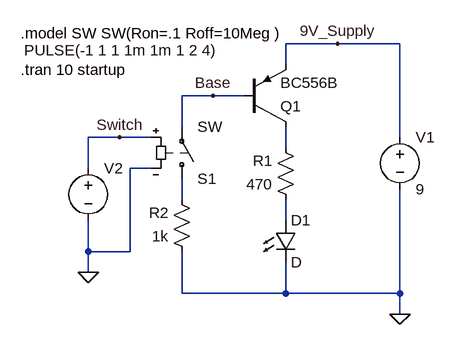
[diagram p0: schematic LTSpice_Example_001.asc]
LTSpice_Example_001.asc, the LTspice schematic file:
Version 4
SHEET 1 880 680
WIRE 208 0 128 0
WIRE 304 0 208 0
WIRE 128 32 128 0
WIRE 16 80 -32 80
WIRE 64 80 16 80
WIRE -32 128 -32 80
WIRE -128 144 -176 144
WIRE -80 144 -128 144
WIRE 304 144 304 0
WIRE 128 160 128 128
WIRE -176 192 -176 144
WIRE -80 192 -112 192
WIRE -32 240 -32 208
WIRE 128 272 128 240
WIRE -176 320 -176 272
WIRE -112 320 -112 192
WIRE -112 320 -176 320
WIRE -176 352 -176 320
WIRE -32 384 -32 320
WIRE 128 384 128 336
WIRE 128 384 -32 384
WIRE 304 384 304 224
WIRE 304 384 128 384
WIRE 304 416 304 384
FLAG 304 416 0
FLAG -176 352 0
FLAG -128 144 Switch
FLAG 208 0 9V_Supply
FLAG 16 80 Base
SYMBOL pnp 64 128 M180
SYMATTR InstName Q1
SYMATTR Value BC556B
SYMBOL res 144 256 R180
WINDOW 0 36 76 Left 2
WINDOW 3 36 40 Left 2
SYMATTR InstName R1
SYMATTR Value 470
SYMBOL res -16 336 R180
WINDOW 0 36 76 Left 2
WINDOW 3 36 40 Left 2
SYMATTR InstName R2
SYMATTR Value 1k
SYMBOL LED 112 272 R0
SYMATTR InstName D1
SYMBOL voltage 304 128 R0
WINDOW 123 0 0 Left 2
WINDOW 39 0 0 Left 2
SYMATTR InstName V1
SYMATTR Value 9
SYMBOL sw -32 224 M180
SYMATTR InstName S1
SYMBOL voltage -176 176 R0
WINDOW 3 -99 -166 Left 2
WINDOW 123 0 0 Left 2
WINDOW 39 0 0 Left 2
SYMATTR Value PULSE(-1 1 1 1m 1m 1 2 4)
SYMATTR InstName V2
TEXT -280 40 Left 2 !.tran 10 startup
TEXT -280 -16 Left 2 !.model SW SW(Ron=.1 Roff=10Meg )

The netlist it stands for:
* LTSpice_Example_001.asc
Q1 N001 Base 9V_Supply 0 BC556B
R1 N003 N001 470
R2 0 N002 1k
D1 N003 0 D
V1 9V_Supply 0 9
S1 N002 Base Switch 0 SW
V2 Switch 0 PULSE(-1 1 1 1m 1m 1 2 4)
.model D D
.lib standard.dio
.model NPN NPN
.model PNP PNP
.lib standard.bjt
.tran 10 startup
.model SW SW(Ron=.1 Roff=10Meg )
.backanno
.end

* Results of the author's LTspice run, read from the files saved beside the schematic
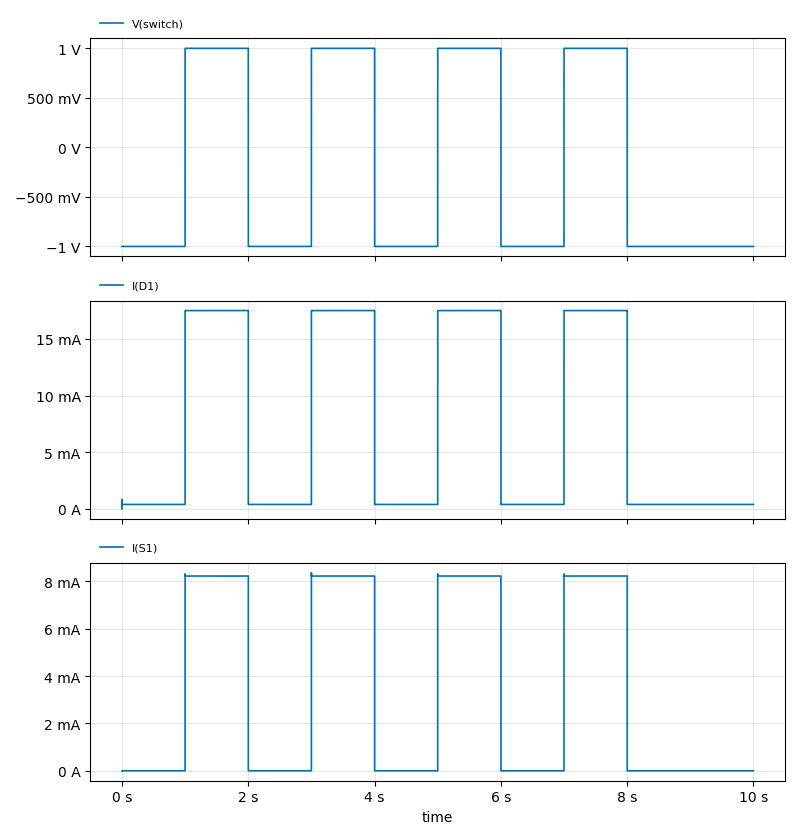
[diagram p1: Transient Analysis of LTSpice_Example_001.asc, plotted from the saved traces]
* Transient Analysis, 1 run:
*   V(switch): min -1 V, max 1 V, average -199.2 mV, rms 999.8 mV, last -1 V
*   I(D1): min 0 A, max 17.51 mA, average 7.231 mA, rms 11.08 mA, last 369.3 µA
*   I(S1): min 0 A, max 8.357 mA, average 3.291 mA, rms 5.2 mA, last 840.7 nA